# EAGLE design sensor (EAGLE 9.6.2)
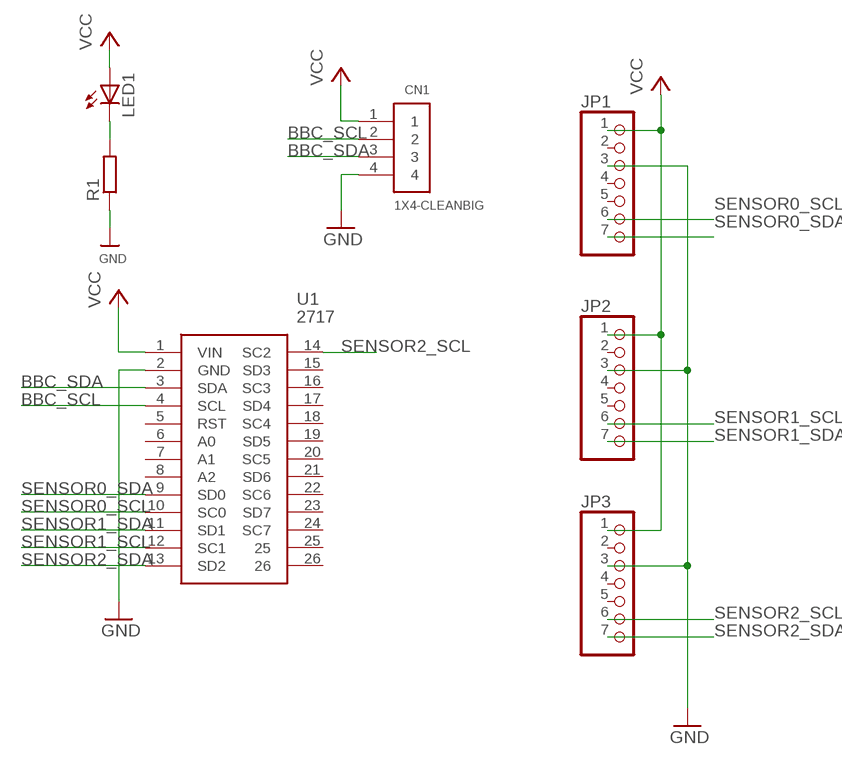
[diagram p0: schematic, sheet 1]

## Parts
CN1  1X4-CLEANBIG  [1X04-CLEANBIG]
JP1  MICROBUILDER_HEADER-1X7  [MICROBUILDER_1X07_OVAL]
JP2  MICROBUILDER_HEADER-1X7  [MICROBUILDER_1X07_OVAL]
JP3  MICROBUILDER_HEADER-1X7  [MICROBUILDER_1X07_OVAL]
LED1  LED3MM  [LED3MM]
R1  R-EU_0204/7  [0204/7]
U1  2717  [2717]

## Nets
BBC_SCL: CN1.2 U1.4(SCL)
BBC_SDA: CN1.3 U1.3(SDA)
GND: CN1.4 JP1.3 JP2.3 JP3.3 R1.1 U1.2(GND)
N$1: LED1.K(C) R1.2
SENSOR0_SCL: JP1.6 U1.10(SC0)
SENSOR0_SDA: JP1.7 U1.9(SD0)
SENSOR1_SCL: JP2.6 U1.12(SC1)
SENSOR1_SDA: JP2.7 U1.11(SD1)
SENSOR2_SCL: JP3.6 U1.14(SC2)
SENSOR2_SDA: JP3.7 U1.13(SD2)
VCC: CN1.1 JP1.1 JP2.1 JP3.1 LED1.A U1.1(VIN)
Unconnected: JP1.2 JP1.4 JP1.5 JP2.2 JP2.4 JP2.5 JP3.2 JP3.4 JP3.5 U1.5(RST) U1.6(A0) U1.7(A1) U1.8(A2) U1.15(SD3) U1.16(SC3) U1.17(SD4) U1.18(SC4) U1.19(SD5) U1.20(SC5) U1.21(SD6) U1.22(SC6) U1.23(SD7) U1.24(SC7) U1.25 U1.26

## Library data of the parts
CN1 = adafruit:1X4: 4-pin connector
JP1-JP3 = Adafruit VL53L0X:MICROBUILDER_HEADER-1X7: PIN HEADER
LED1 = adafruit:LED: LED OSRAM: - CHIPLED LG R971, LG N971, LY N971, LG Q971, LY Q971, LO R971, LY R971 LH N974, LH R974 LS Q976, LO Q976, LY Q976 LO Q996 - Hyper CHIPLED LW Q18S LB Q993, LB Q99A, LB R99A - SideLED LS A670, LO A670, LY A670, LG A670, LP A670 LB A673, LV A673, LT A673, LW A673 LH A674 LY A675 LS A676, LA A676, LO A676, LY A676, LW A676 LS A679, LY A679, LG A679 - Hyper Micro SIDELED® LS Y876, LA Y876, LO Y876, LY Y876 LT Y87S - SmartLED LW L88C, LW L88S LB L89C, LB L89S, LG L890 LS L89K, LO L89K, LY L89K LS L896, LA L896, LO L896, LY L896 - TOPLED LS T670, LO T670, LY T670, LG T670, LP T670 LSG T670, LSP T670, LSY T670, LOP T670, LYG T670 LG T671, LOG T671, LSG T671 LB T673, LV T673, LT T673, LW T673 LH T674 LS T676, LA T676, LO T676, LY T676, LB T676, LH T676, LSB T676, LW T676 LB T67C, LV T67C, LT T67C, LS T67K, LO T67K, LY T67K, LW E67C LS E67B, LA E67B, LO E67B, LY E67B, LB E67C, LV E67C, LT E67C LW T67C LS T679, LY T679, LG T679 LS T770, LO T770, LY T770, LG T770, LP T770 LB T773, LV T773, LT T773, LW T773 LH T774 LS E675, LA E675, LY E675, LS T675 LS T776, LA T776, LO T776, LY T776, LB T776 LHGB T686 LT T68C, LB T68C - Hyper Mini TOPLED® LB M676 - Mini TOPLED Santana® LG M470 LS M47K, LO M47K, LY M47K Source: http://www.osram.convergy.de/
R1 = resistor:R-EU_: RESISTOR, European symbol
U1 = TCA9548A_m:2717: Switch IC Development Tools TCA9548A I2C Multiplexer Source: Datasheet <https://learn.adafruit.com/downloads/pdf/adafruit-tca9548a-1-to-8-i2c-multiplexer-breakout.pdf>; DESCRIPTION: Switch IC Development Tools TCA9548A I2C Multiplexer; HEIGHT: 1mm; MANUFACTURER_NAME: Adafruit; MANUFACTURER_PART_NUMBER: 2717; MOUSER_PART_NUMBER: 485-2717; MOUSER_PRICE-STOCK: https://www.mouser.com/Search/Refine.aspx?Keyword=485-2717

## Board
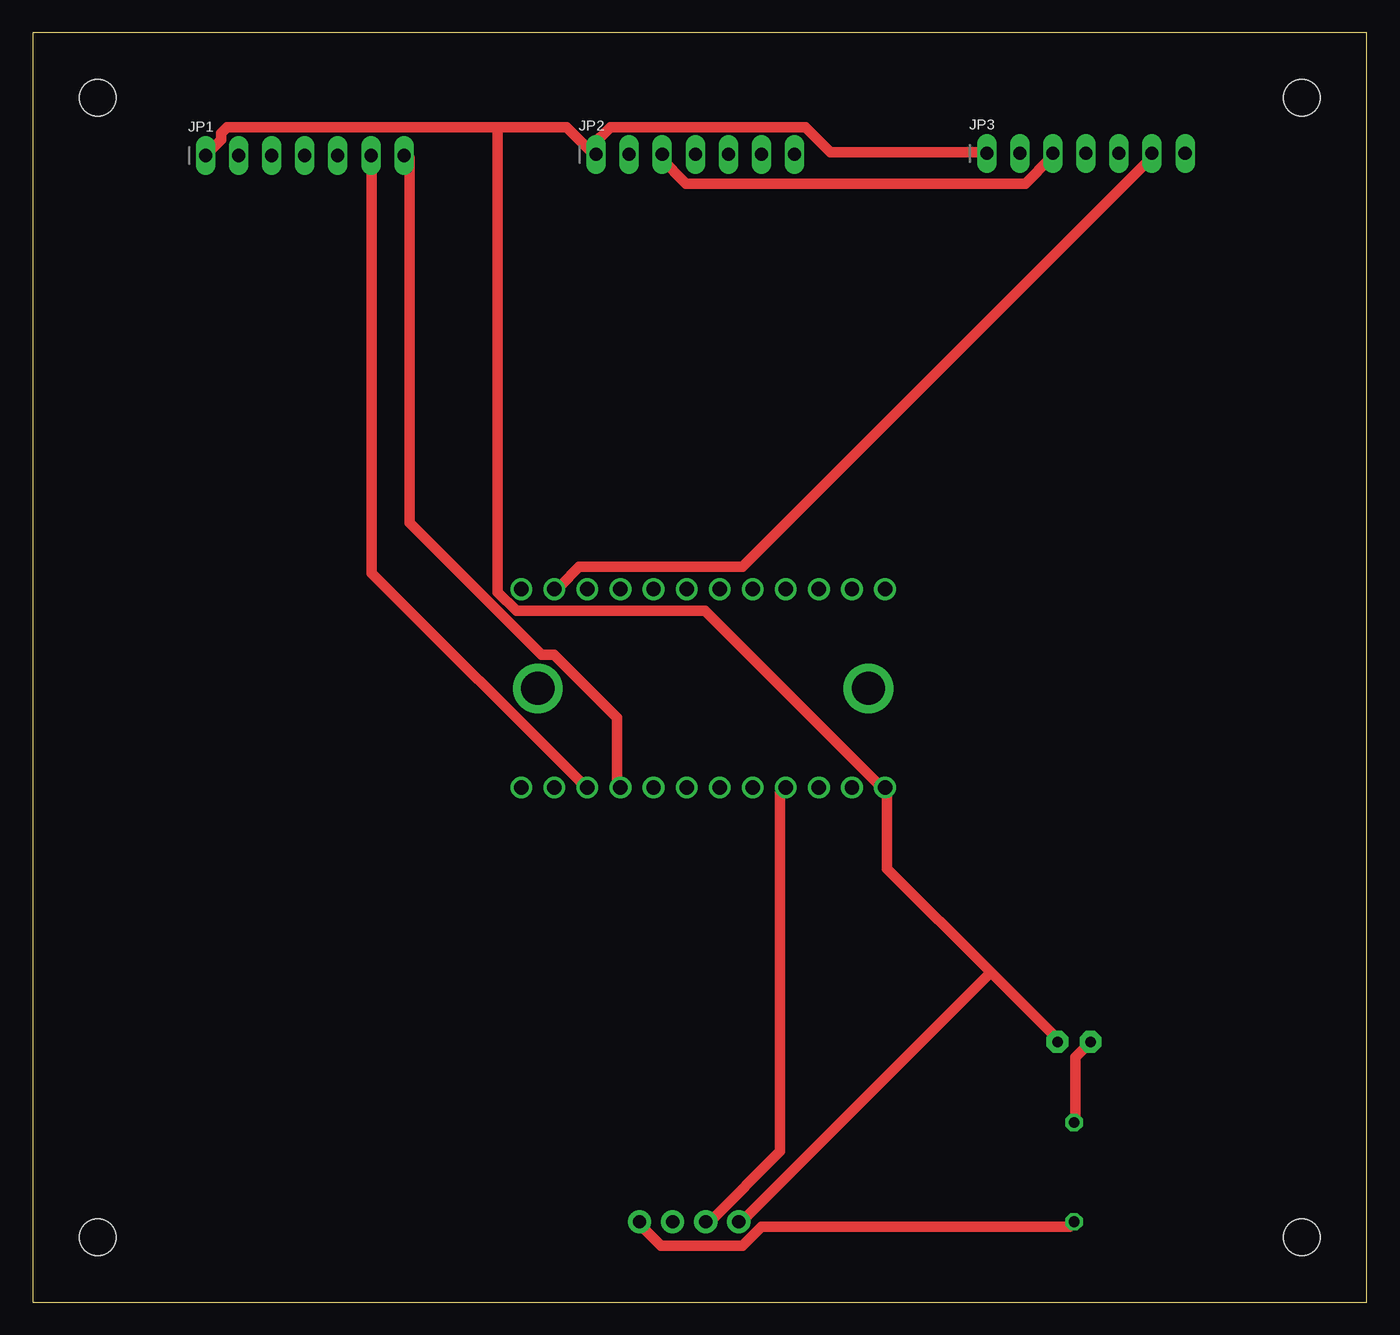
[diagram p1: board, top side]
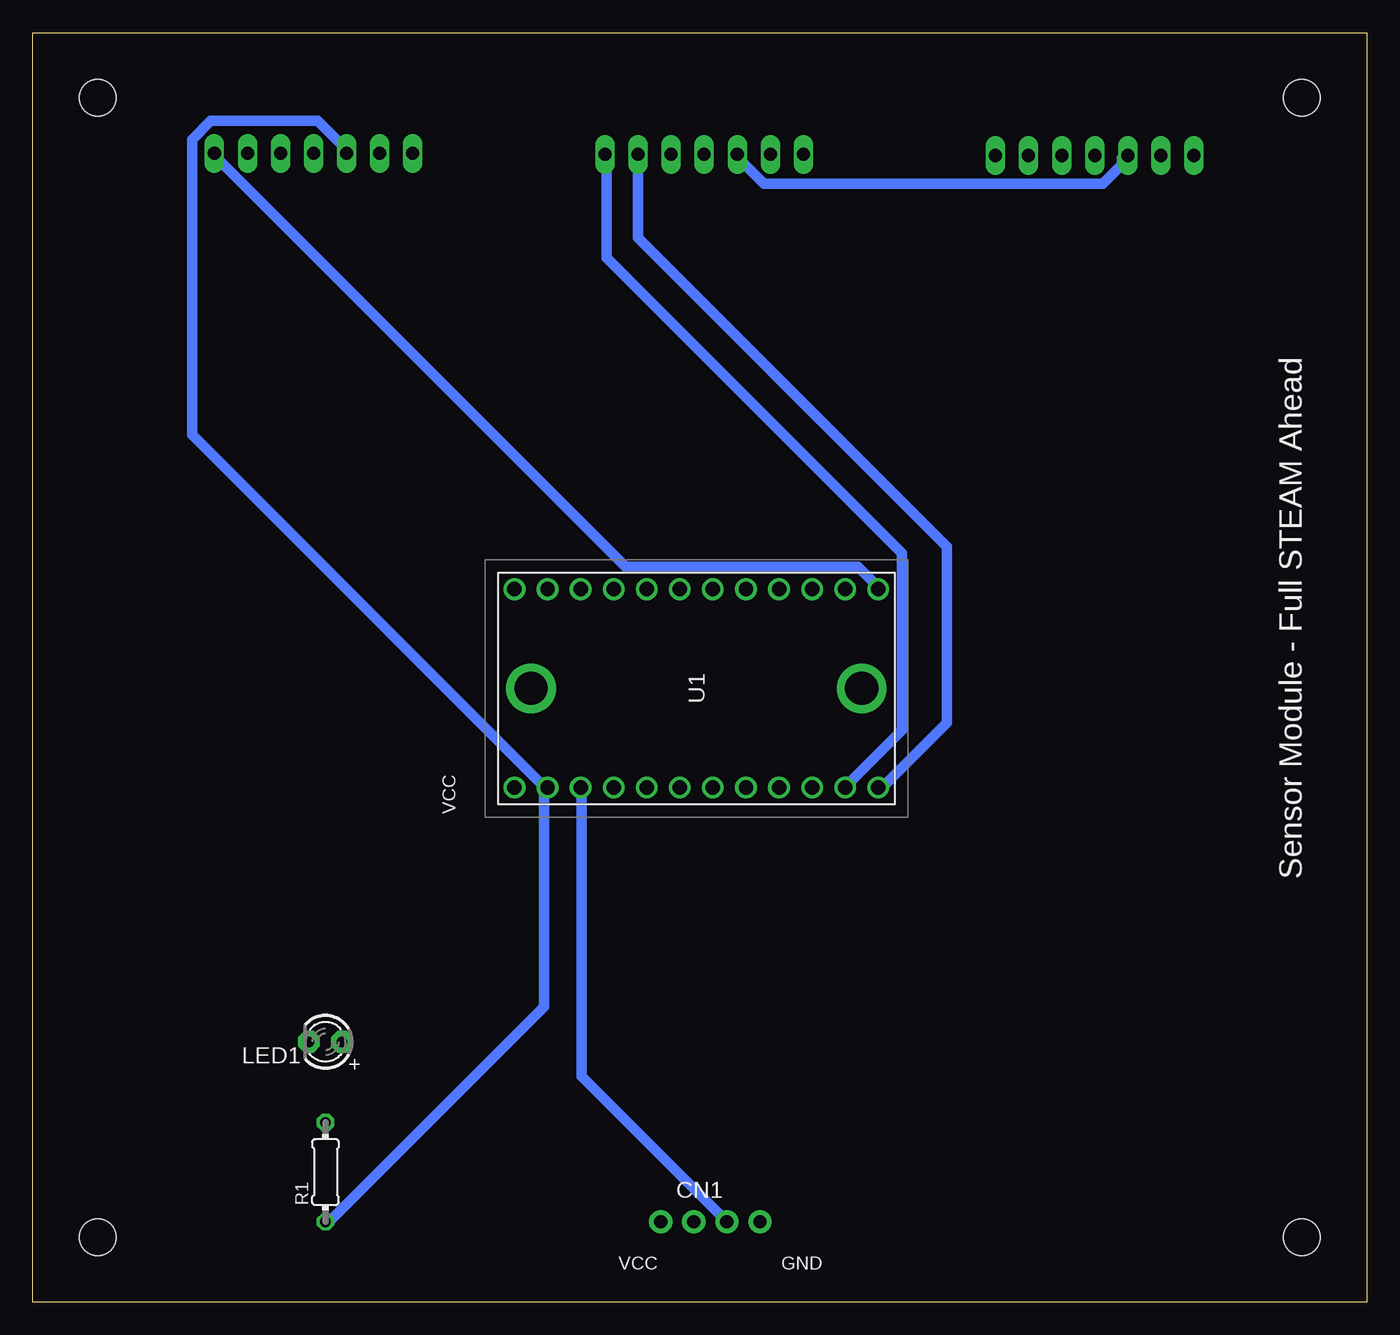
[diagram p2: board, bottom side, seen from below]

Size 102.5 x 97.5 mm. Coordinates in mm from the lower left corner, seen from the top.
Outline: 0,0 102.5,0 102.5,97.5 0,97.5 0,0
Copper layers (1*16): Top 0.035mm / dielectric 1.5mm / Bottom 0.035mm
Design rules "default *": minimum track width 32mil, minimum drill 0.35mm, track to track 6mil, track to pad 6mil, pad to pad 6mil, via to via 6mil, smd to smd 6mil, copper to edge 40mil, drill to drill 6mil, minimum pad ring 10mil, minimum via ring 8mil, stop-mask expansion 4mil, vias tented up to drill 0mil, thermal gap 10mil
Holes 2.8 mm at 5,92.5 97.5,92.5 5,5 97.5,5

### Footprints (pad centres in the part's own frame; a part is rotated, then mirrored left to right if it is on the bottom)
1X04-CLEANBIG = drill 1.016 pad 1.778: 1 -3.81,0; 2 -1.27,0; 3 1.27,0; 4 3.81,0
MICROBUILDER_1X07_OVAL = drill 1 long: 1 -7.62,0; 2 -5.08,0; 3 -2.54,0; 4 0,0; 5 2.54,0; 6 5.08,0; 7 7.62,0
LED3MM = drill 0.813 pad 1.676 octagon: A -1.27,0; K 1.27,0
0204/7 = drill 0.813 octagon: 1 -3.81,0; 2 3.81,0
2717 = drill 1.11 pad 1.665: 1 -7.62,13.97; 2 -7.62,11.43; 3 -7.62,8.89; 4 -7.62,6.35; 5 -7.62,3.81; 6 -7.62,1.27; 7 -7.62,-1.27; 8 -7.62,-3.81; 9 -7.62,-6.35; 10 -7.62,-8.89; 11 -7.62,-11.43; 12 -7.62,-13.97; 13 7.62,-13.97; 14 7.62,-11.43; 15 7.62,-8.89; 16 7.62,-6.35; 17 7.62,-3.81; 18 7.62,-1.27; 19 7.62,1.27; 20 7.62,3.81; 21 7.62,6.35; 22 7.62,8.89; 23 7.62,11.43; 24 7.62,13.97 | drill 2.54 pad 3.81: 25 0,12.7; 26 0,-12.7

### Placement (x,y rotation side)
CN1  50.44,6.19 0 bottom
JP1  20.91,88.06 0 top
JP2  50.91,88.14 0 top
JP3  80.91,88.22 0 top
LED1  80,20 180 bottom
R1  80,10 90 bottom
U1  51.51,47.14 90 bottom

### Tracks (layer width: path | path; a pad name or v marks a point on that pad's centre or on a via)
BBC_SCL
  Top 0.813: U1.4 57.43,39.09 57.43,11.58 52.12,6.27 CN1.2
BBC_SDA
  Bottom 0.813: U1.3 60.33,39.09 60.33,17.37 49.23,6.27 CN1.3
GND
  Top 0.813: JP3.3 78.18,87.83 76.25,85.9 50.19,85.9 48.26,87.83 JP2.3 | R1.1 79.63,5.79 55.98,5.79 54.53,4.34 48.26,4.34 46.81,5.79 CN1.4
  Bottom 0.813: JP1.3 18.82,87.83 18.82,87.35 20.27,85.9 46.33,85.9 48.26,87.83 JP2.3 | R1.1 79.63,6.27 63.22,22.68 63.22,39.09 U1.2 63.22,39.57 90.25,66.6 90.25,89.28 88.8,90.73 80.59,90.73 78.66,88.8 78.66,88.32 JP3.3
N$1
  Top 0.813: R1.2 80.11,13.99 80.11,18.82 81.08,19.79 LED1.K
SENSOR0_SCL
  Top 0.813: JP1.6 26.06,87.83 26.06,55.98 42.47,39.57 U1.10
SENSOR0_SDA
  Top 0.813: JP1.7 28.96,87.83 28.96,59.84 39.09,49.71 40.06,49.71 44.88,44.88 44.88,39.57 U1.9
SENSOR1_SCL
  Bottom 0.813: JP2.6 55.98,87.83 55.98,81.73 32.25,58 32.25,44.49 37.16,39.57 U1.12
SENSOR1_SDA
  Bottom 0.813: JP2.7 58.4,87.83 58.4,80.2 35.71,57.52 35.71,43.92 40.06,39.57 U1.11
SENSOR2_SCL
  Top 0.813: JP3.6 85.9,87.83 54.53,56.46 41.99,56.46 40.54,55.02 U1.14
SENSOR2_SDA
  Bottom 0.813: JP3.7 88.32,87.83 56.95,56.46 39.09,56.46 37.64,55.02 U1.13
VCC
  Top 0.813: 73.6,25.34 78.66,20.27 LED1.A | 73.6,25.34 65.63,33.3 65.63,39.09 U1.1 65.15,39.57 51.64,53.09 37.16,53.09 35.71,54.53 35.71,90.25 | 73.6,25.34 54.53,6.27 CN1.1 | 35.71,90.25 41.02,90.25 42.95,88.32 JP2.1 42.95,88.8 44.4,90.25 59.36,90.25 61.29,88.32 72.87,88.32 JP3.1 | 35.71,90.25 14.96,90.25 14.48,89.76 14.48,89.28 13.51,88.32 JP1.1

### Text on the board
bPlace: VCC | Sensor Module - Full STEAM Ahead | GND | VCC